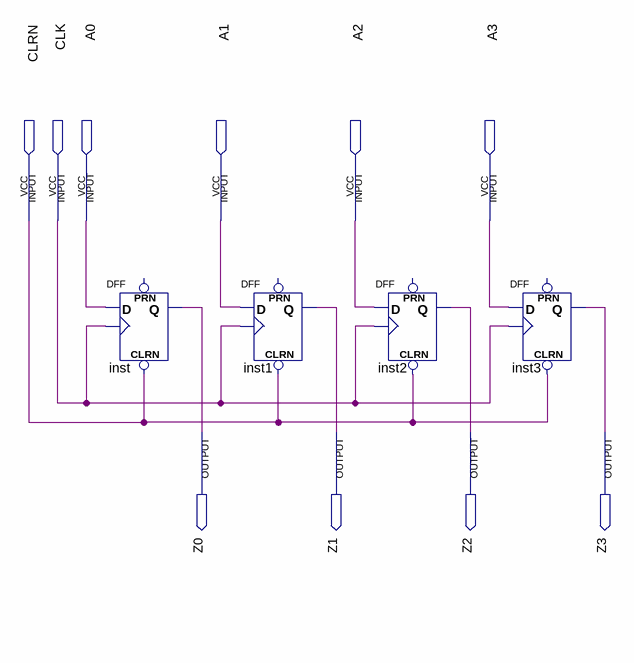
[diagram p0: schematic sheet]
// Quartus schematic Register.bdf as structural Verilog: 4 symbols, 10 pins
module Register (
  input  CLRN,
  input  CLK,
  input  A0,
  input  A1,
  input  A2,
  input  A3,
  output Z0,
  output Z1,
  output Z2,
  output Z3
);

  DFF inst (.CLRN(CLRN), .CLK(CLK), .D(A0), .Q(Z0));  // open: PRN
  DFF inst1 (.CLRN(CLRN), .CLK(CLK), .D(A1), .Q(Z1));  // open: PRN
  DFF inst2 (.CLRN(CLRN), .CLK(CLK), .D(A2), .Q(Z2));  // open: PRN
  DFF inst3 (.CLRN(CLRN), .CLK(CLK), .D(A3), .Q(Z3));  // open: PRN
endmodule
